# Altium schematic sheet power.SchDoc
size A
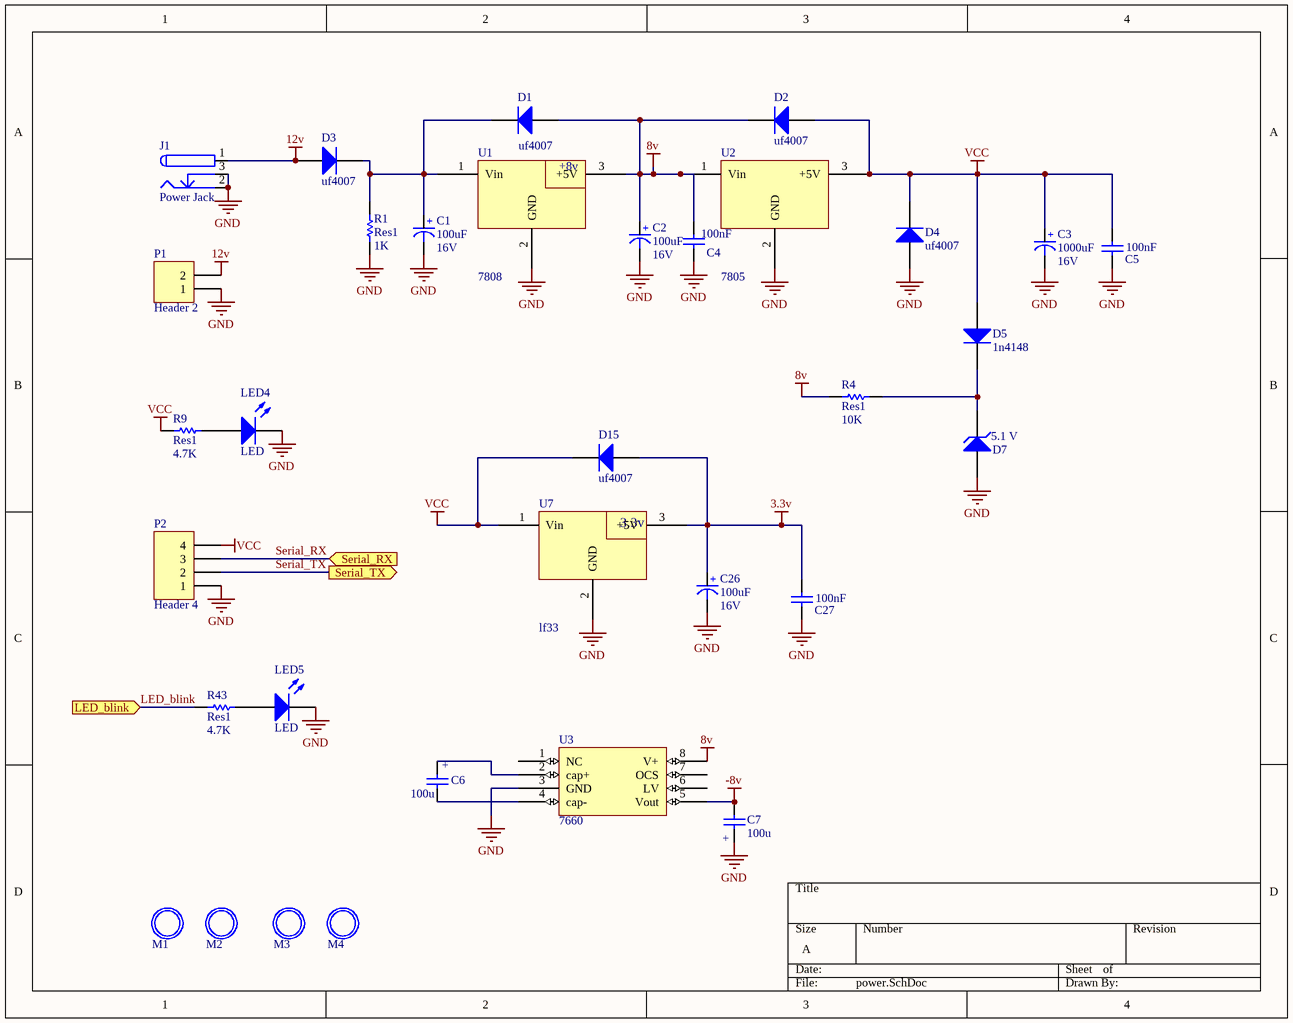
[diagram p0: power.SchDoc]

## Parts
C1  Voltage: 16V  [cap 01]  (hidden comment: 100uF)
C2  Voltage: 16V  [cap 01]  (hidden comment: 100uF)
C3  Voltage: 16V  [cap 03]  (hidden comment: 1000uF)
C4  value 100nF  [CAP 1206 (3216X15L)]  (hidden comment: Cap)
C5  value 100nF  [CAP 1206 (3216X15L)]  (hidden comment: Cap)
C6  value 100u  [cap 01]  (hidden comment: Cap)
C7  value 100u  [cap 01]  (hidden comment: Cap)
C26  Voltage: 16V  [cap 01]  (hidden comment: 100uF)
C27  value 100nF  [CAP 1206 (3216X15L)]  (hidden comment: Cap)
D1  uf4007  [SMA DIODE 2]
D2  uf4007  [SMA DIODE 2]
D3  uf4007  [SMA DIODE 2]
D4  uf4007  [SMA DIODE 2]
D5  1n4148  [LL4148]
D7  Voltage: 5.1 V  [LL4148]  (hidden comment: Diode Zener)
D15  uf4007  [SMA DIODE 2]
J1  Power Jack  [Power Jack]
LED4  LED  [LED 1206]
LED5  LED  [LED 1206]
M1  Screw  [Board Screw]  (value not drawn)
M2  Screw  [Board Screw]  (value not drawn)
M3  Screw  [Board Screw]  (value not drawn)
M4  Screw  [Board Screw]  (value not drawn)
P1  Header 2  [HDR1X2]
P2  Header 4  [HDR1X4]
R1  Res1  value 1K  [RES 1206 (3216X08L)]
R4  Res1  value 10K  [RES 1206 (3216X08L)]
R9  Res1  value 4.7K  [RES 1206 (3216X08L)]
R43  Res1  value 4.7K  [RES 1206 (3216X08L)]
U1  7808  [REG-7805-WALL]
U2  7805  [REG-7805-WALL]
U3  7660  [SOIC8-Narrow]
U7  lf33  [REG-7805-WALL]

## Ports
LED_blink (in), Serial_RX (in), Serial_TX (out)

## Nets
3.3v: C26.1(+) C27.2 D15.1(A) U7.3(+5V)
8v: C2.1(+) C4.2 D1.1(A) D2.2(K) R4.1 U1.3(+5V) U2.1(Vin) U3.8(V+)
12v: D3.1(A) J1.1 P1.2
-8v: C7.- U3.5(Vout)
GND: C1.2(-) C2.2(-) C3.2(-) C4.1 C5.1 C7.+ C26.2(-) C27.1 D4.1(A) D7.1(A) J1.2 J1.3 LED4.K LED5.K P1.1 P2.1 R1.1 U1.2(GND) U2.2(GND) U3.3(GND) U7.2(GND)
VCC: C3.1(+) C5.2 D2.1(A) D4.2(K) D5.1(A) D15.2(K) P2.4 R9.1 U2.3(+5V) U7.1(Vin)
LED_blink: R43.1 ; port LED_blink
Serial_RX: P2.3 ; port Serial_RX
Serial_TX: P2.2 ; port Serial_TX
NetC1_1: C1.1(+) D1.2(K) D3.2(K) R1.2 U1.1(Vin)
NetC6_+: C6.+ U3.2(cap+)
NetC6_-: C6.- U3.4(cap-)
NetD5_2: D5.2(K) D7.2(K) R4.2
NetLED4_A: LED4.A R9.2
NetLED5_A: LED5.A R43.2

Not connected (* = marked no-connect by the designer): U3 1(NC) 6(LV) 7(OCS)

## Notes on the sheet
- (near U1) +9v
- (near U1) +8v
- (near U7) 3.3v

## Library data of the parts
C1-C3 C26 = Cap-Polar: Polar Capacitor; Designer: Saeid Jorablo; Organazation: ControTec; Adding Date: 1387/12/20
  C1 C2 C26: Value: 100uF
  C3: Value: 1000uF
C4 C5 C27 = Cap ceramic: CAP-100Nf
C6 C7 = Cap Pol: CAP-3300Uf; pin to pad: +>1 ->2
D1-D4 D15 = Diode 1N4007: 1 Amp General Purpose Rectifier; Published: 8-Jun-2000; LatestRevisionDate: 17-Jul-2002; LatestRevisionNote: Re-released for DXP Platform.; DatasheetVersion: 1998; PackageVersion: Aug-1999; PackageReference: DO-41; Publisher: Altium Limited; PackageDescription: Diode, Axial; Body 5.2 x 2.7 mm (LxDia. max), Lead Dia. 0.86 mm (max); Code_JEDEC: DO-204-AL; ComponentLink1Description: Manufacturer Link; ComponentLink1URL: http://www.fairchildsemi.com/; ComponentLink2Description: Datasheet; ComponentLink2URL: http://www.fairchildsemi.com/ds/1N%2F1N4001.pdf
D5 = Diode 1N4148: High Conductance Fast Diode; Published: 8-Jun-2000; LatestRevisionDate: 17-Jul-2002; LatestRevisionNote: Re-released for DXP Platform.; DatasheetVersion: 1997; PackageReference: DO-35; Publisher: Altium Limited; PackageDescription: Diode, Axial; Body 3.8 x 1.9 mm (LxDia. max), Lead Dia. 0.53 mm (max); Code_JEDEC: DO-204-AH; ComponentLink1Description: Manufacturer Link; ComponentLink1URL: http://www.fairchildsemi.com/; ComponentLink2Description: Datasheet; ComponentLink2URL: http://www.fairchildsemi.com/ds/1N%2F1N4148.pdf
D7 = Diode Zener: Zener Diode; Designer: Saeid Jorablo; Company: E.P.I.L; Design Date: 2011/11/02
J1 = Power Jack: Designer: Saeid Jorablo; Company: Personal; Project Name: Laser; Adding Date: 10/21/2009
LED4 LED5 = LED: Typical INFRARED GaAs LED; pin to pad: A>1 K>2; Published: 8-Jun-2000; LatestRevisionDate: 08-Jul-2005; LatestRevisionNote: Mech Layer 1 removed.; Publisher: Altium Limited
M1-M4 = Board Screw: Board Screw With Spacer
P1 = Header 2: Header, 2-Pin; LatestRevisionDate: 17-Jul-2002; LatestRevisionNote: Re-released for DXP Platform.; Publisher: Altium Limited
P2 = Header 4: Header, 4-Pin; LatestRevisionDate: 17-Jul-2002; LatestRevisionNote: Re-released for DXP Platform.; Publisher: Altium Limited
R1 R4 R9 R43 = Res1: Resistor; Published: 8-Jun-2000; LatestRevisionDate: 17-Jul-2002; LatestRevisionNote: Re-released for DXP Platform.; PackageReference: AXIAL-0.3; Publisher: Altium Limited; PackageDescription: Axial Device, Thru-Hole; 2 Leads; 0.3 in Pin Spacing
U1 U2 U7 = 7805: Regulator